# EAGLE schematic Altimeter (EAGLE 9.5.0)
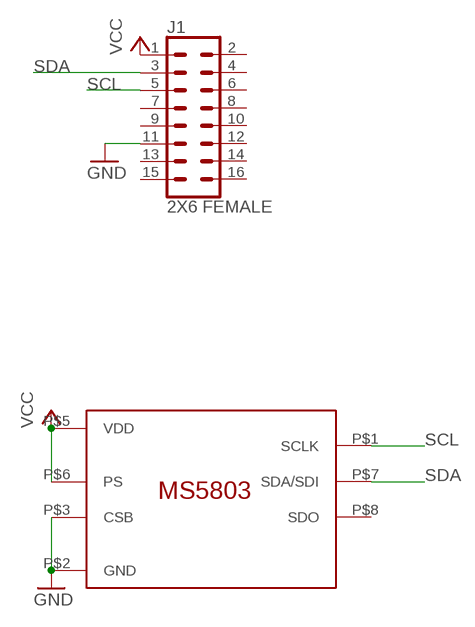
[diagram p0: schematic, sheet 1]

## Parts
J1  2X6 FEMALE  SENSOR_BREAKOUTPTH_FEMALE  [2X7]
U$1  MS5803  [MS5803]

## Nets
GND: J1.11 U$1.P$2(GND) U$1.P$3(CSB)
SCL: J1.5 U$1.P$1(SCLK)
SDA: J1.3 U$1.P$7(SDA/SDI)
VCC: J1.1 U$1.P$5(VDD) U$1.P$6(PS)
Unconnected: J1.2 J1.4 J1.6 J1.7 J1.8 J1.9 J1.10 J1.12 J1.13 J1.14 J1.15 J1.16 U$1.P$8(SDO)

## Library data of the parts
J1 = RTR:SENSOR_BREAKOUT: .1 inch-spaced 12P sensor breakout Used as a generalized connector for attaching new sensors; PROD_ID: CONN-12423
U$1 = MS5803:MS5803